# EasyEDA schematic Prática-01.json
TITLE: Sheet_1; REV: 1.0; Date: 2020-08-23; Sheet: 1/1; Company: Your Company
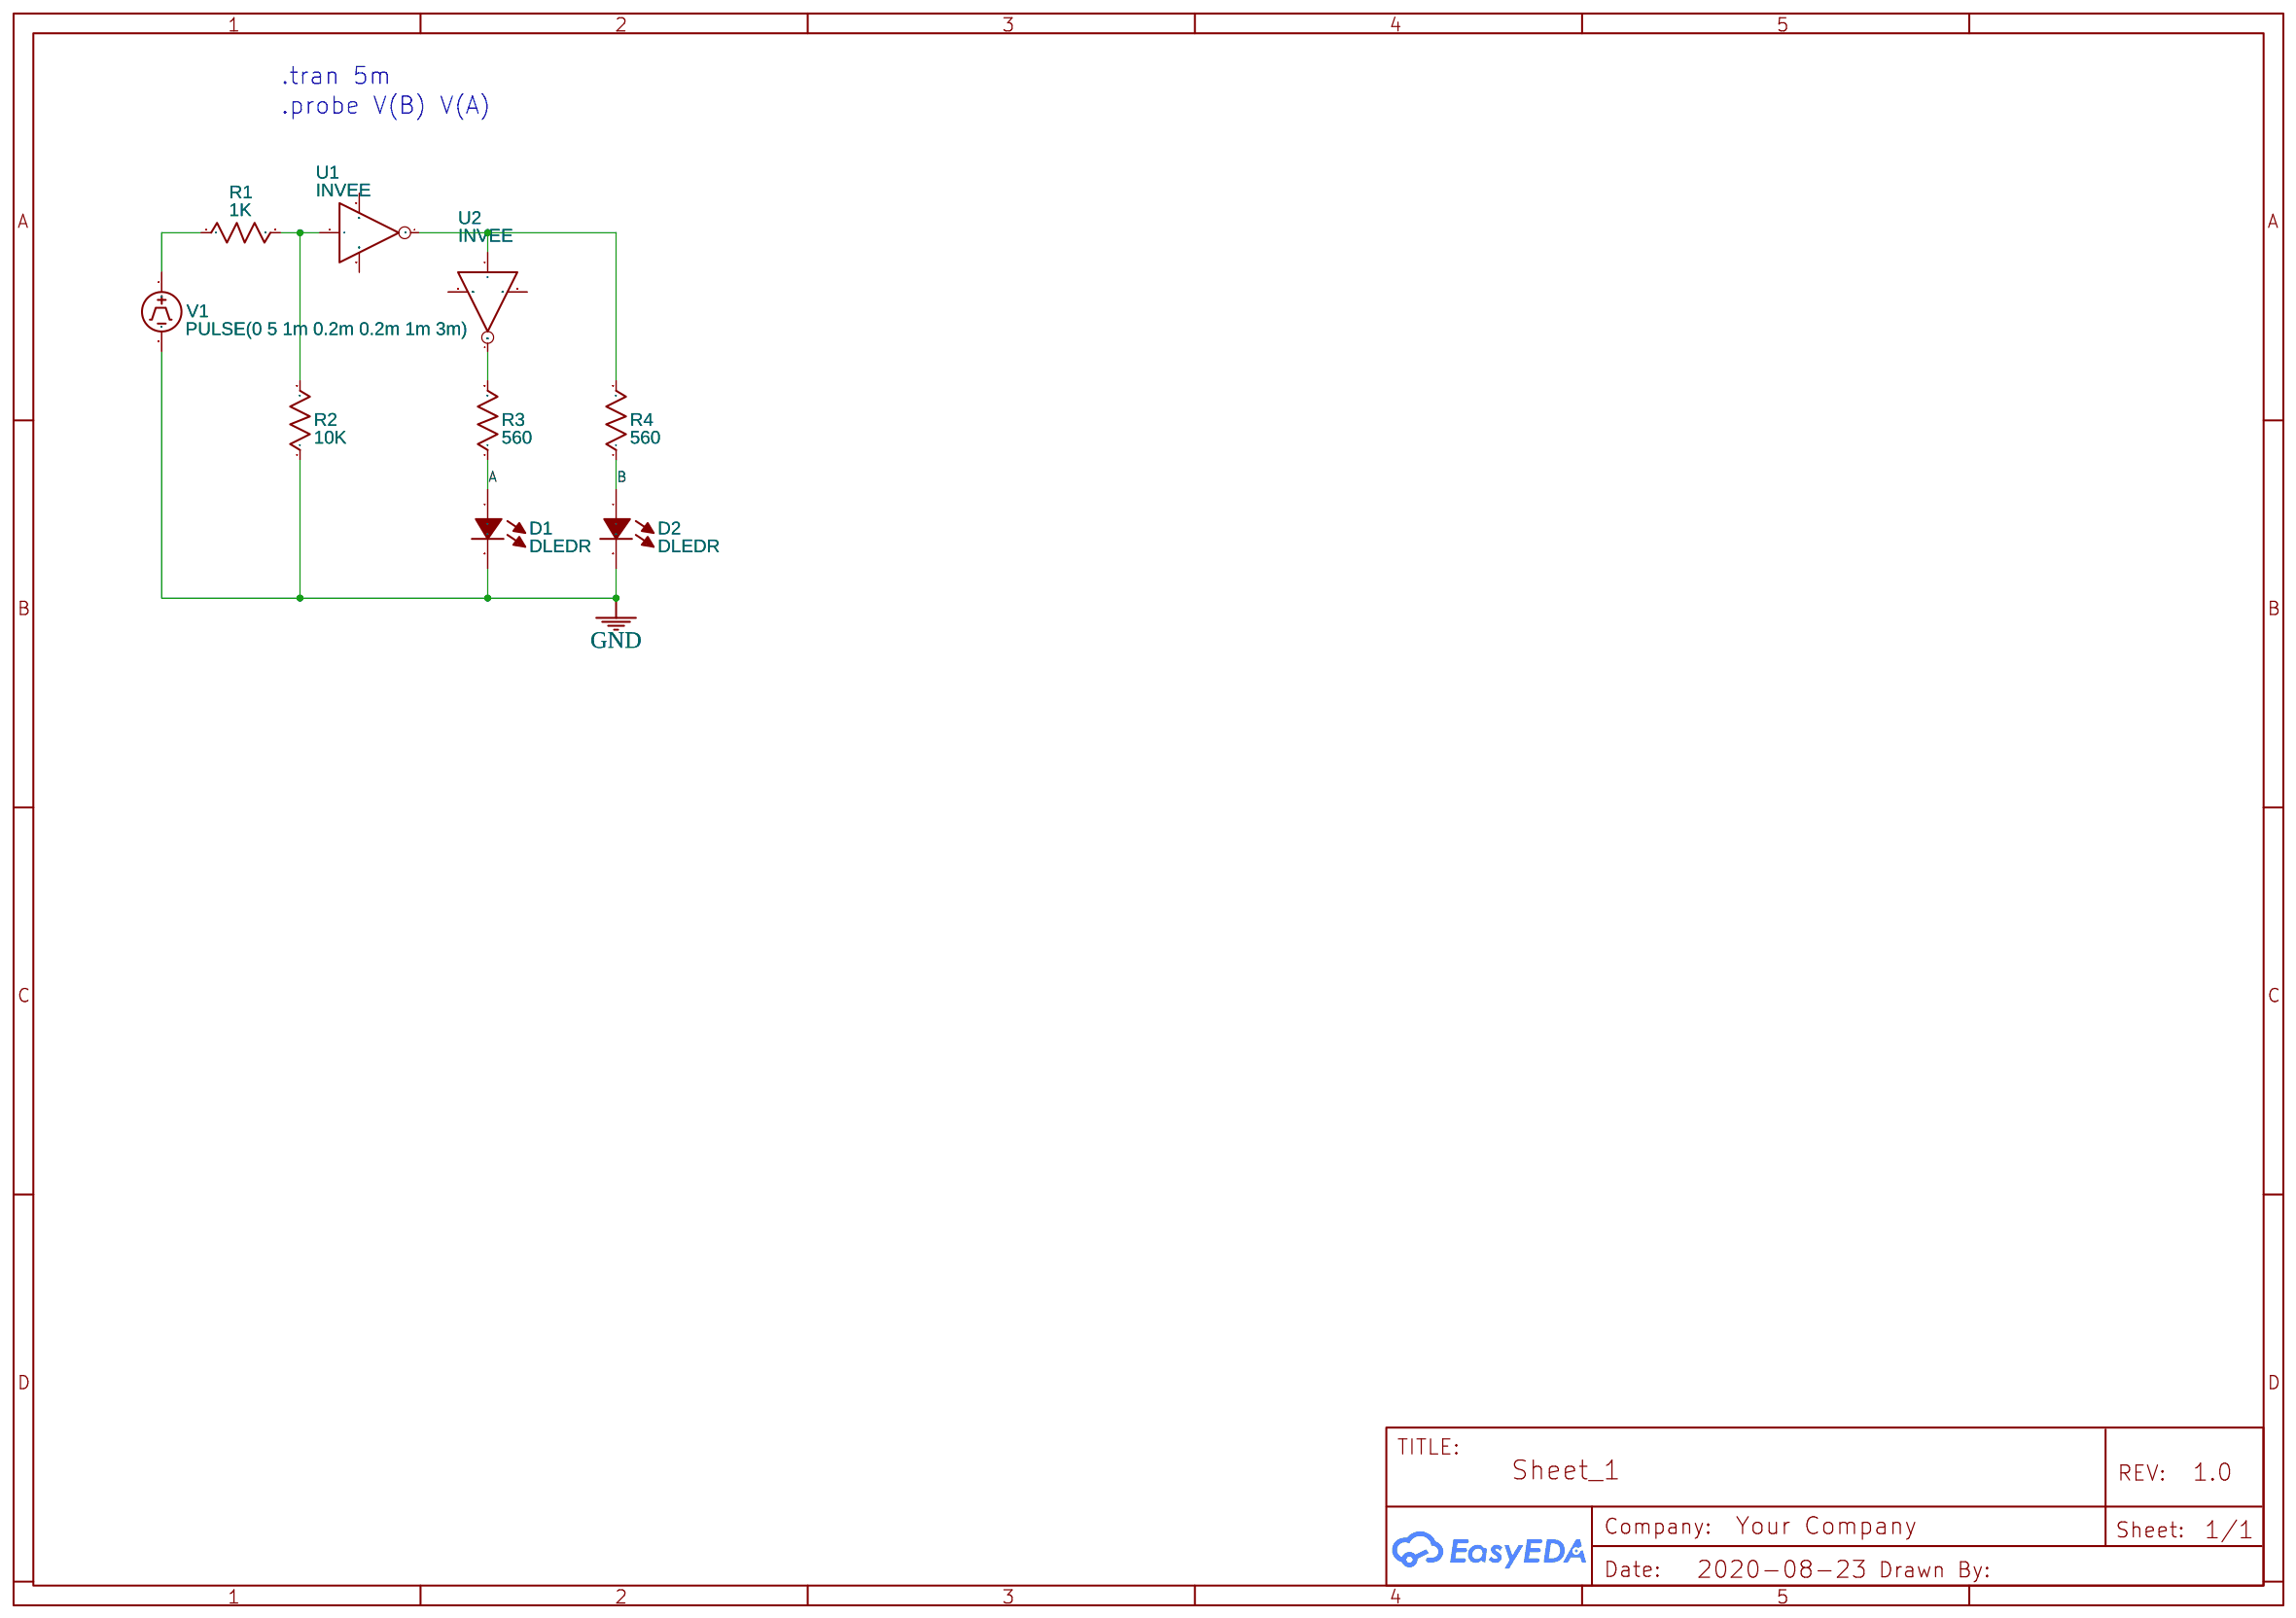
[diagram p0: schematic sheet]

## Parts
D1  DLEDR  [LED3MM]
D2  DLEDR  [LED3MM]
R1  1K  [AXIAL-0.3]
R2  10K  [AXIAL-0.3]
R3  560  [AXIAL-0.3]
R4  560  [AXIAL-0.3]
U1  INVEE
U2  INVEE
V1  PULSE(0 5 1m 0.2m 0.2m 1m 3m)  [HDR1X2]

## Library data of the parts
D1 D2 = DLEDR: sourceId: 39lVhsq0A; sim: true
R1-R4 = Resistor_US: Resistance: 1k; Contributor: EasyEDA; Supplier: YUJING
U1 U2 = LOGIC: Contributor: EasyEDA
V1 = VPULSE: Contributor: EasyEDA; sim: true

## Nets
GND: D1.2(C) D2.2(C) R2.1 V1.2
A: D1.1(A) R3.1
B: D2.1(A) R4.1
Net-(R1-1): R1.1 V1.1
Net-(R1-2): R1.2 R2.2 U1.1(IN)
Net-(R3-2): R3.2 U2.4(OUT)
Net-(R4-2): R4.2 U1.4(OUT) U2.1(IN)

Not connected (* = marked no-connect by the designer): U1 2(VDD) 3(GND); U2 2(VDD) 3(GND)

## Notes on the sheet
- .tran 5m
- .probe V(B) V(A)
